# Altium schematic sheet 06_LMS7002M_Power.SchDoc: LMS7002M 1 power supply
size A3 portrait; Organization: Lime Microsystems; Address1: Surrey Tech Centre; Address2: Guildford GU2 7YG; Address3: Surrey; Address4: United Kingdom; Revision: SoDeRa-PCI v1.0; SheetNumber: 6; SheetTotal: 15; PageSetup: Record=PageOptions|CenterHorizontal=True|CenterVertical=True|PrintScale=0.70|XCorrection=1.00|YCorrection=1.00|PrintKind=1|BorderSize=5000000|LeftOffset=0|BottomOffset=0|Orientation=1|PaperLength=2970|PaperWidth=2100|Scale=100|PaperSource=7|PrintQuality=600|MediaType=1|DitherType=10|PrintScaleMode=1|PaperKind=A4|PaperIndex=9
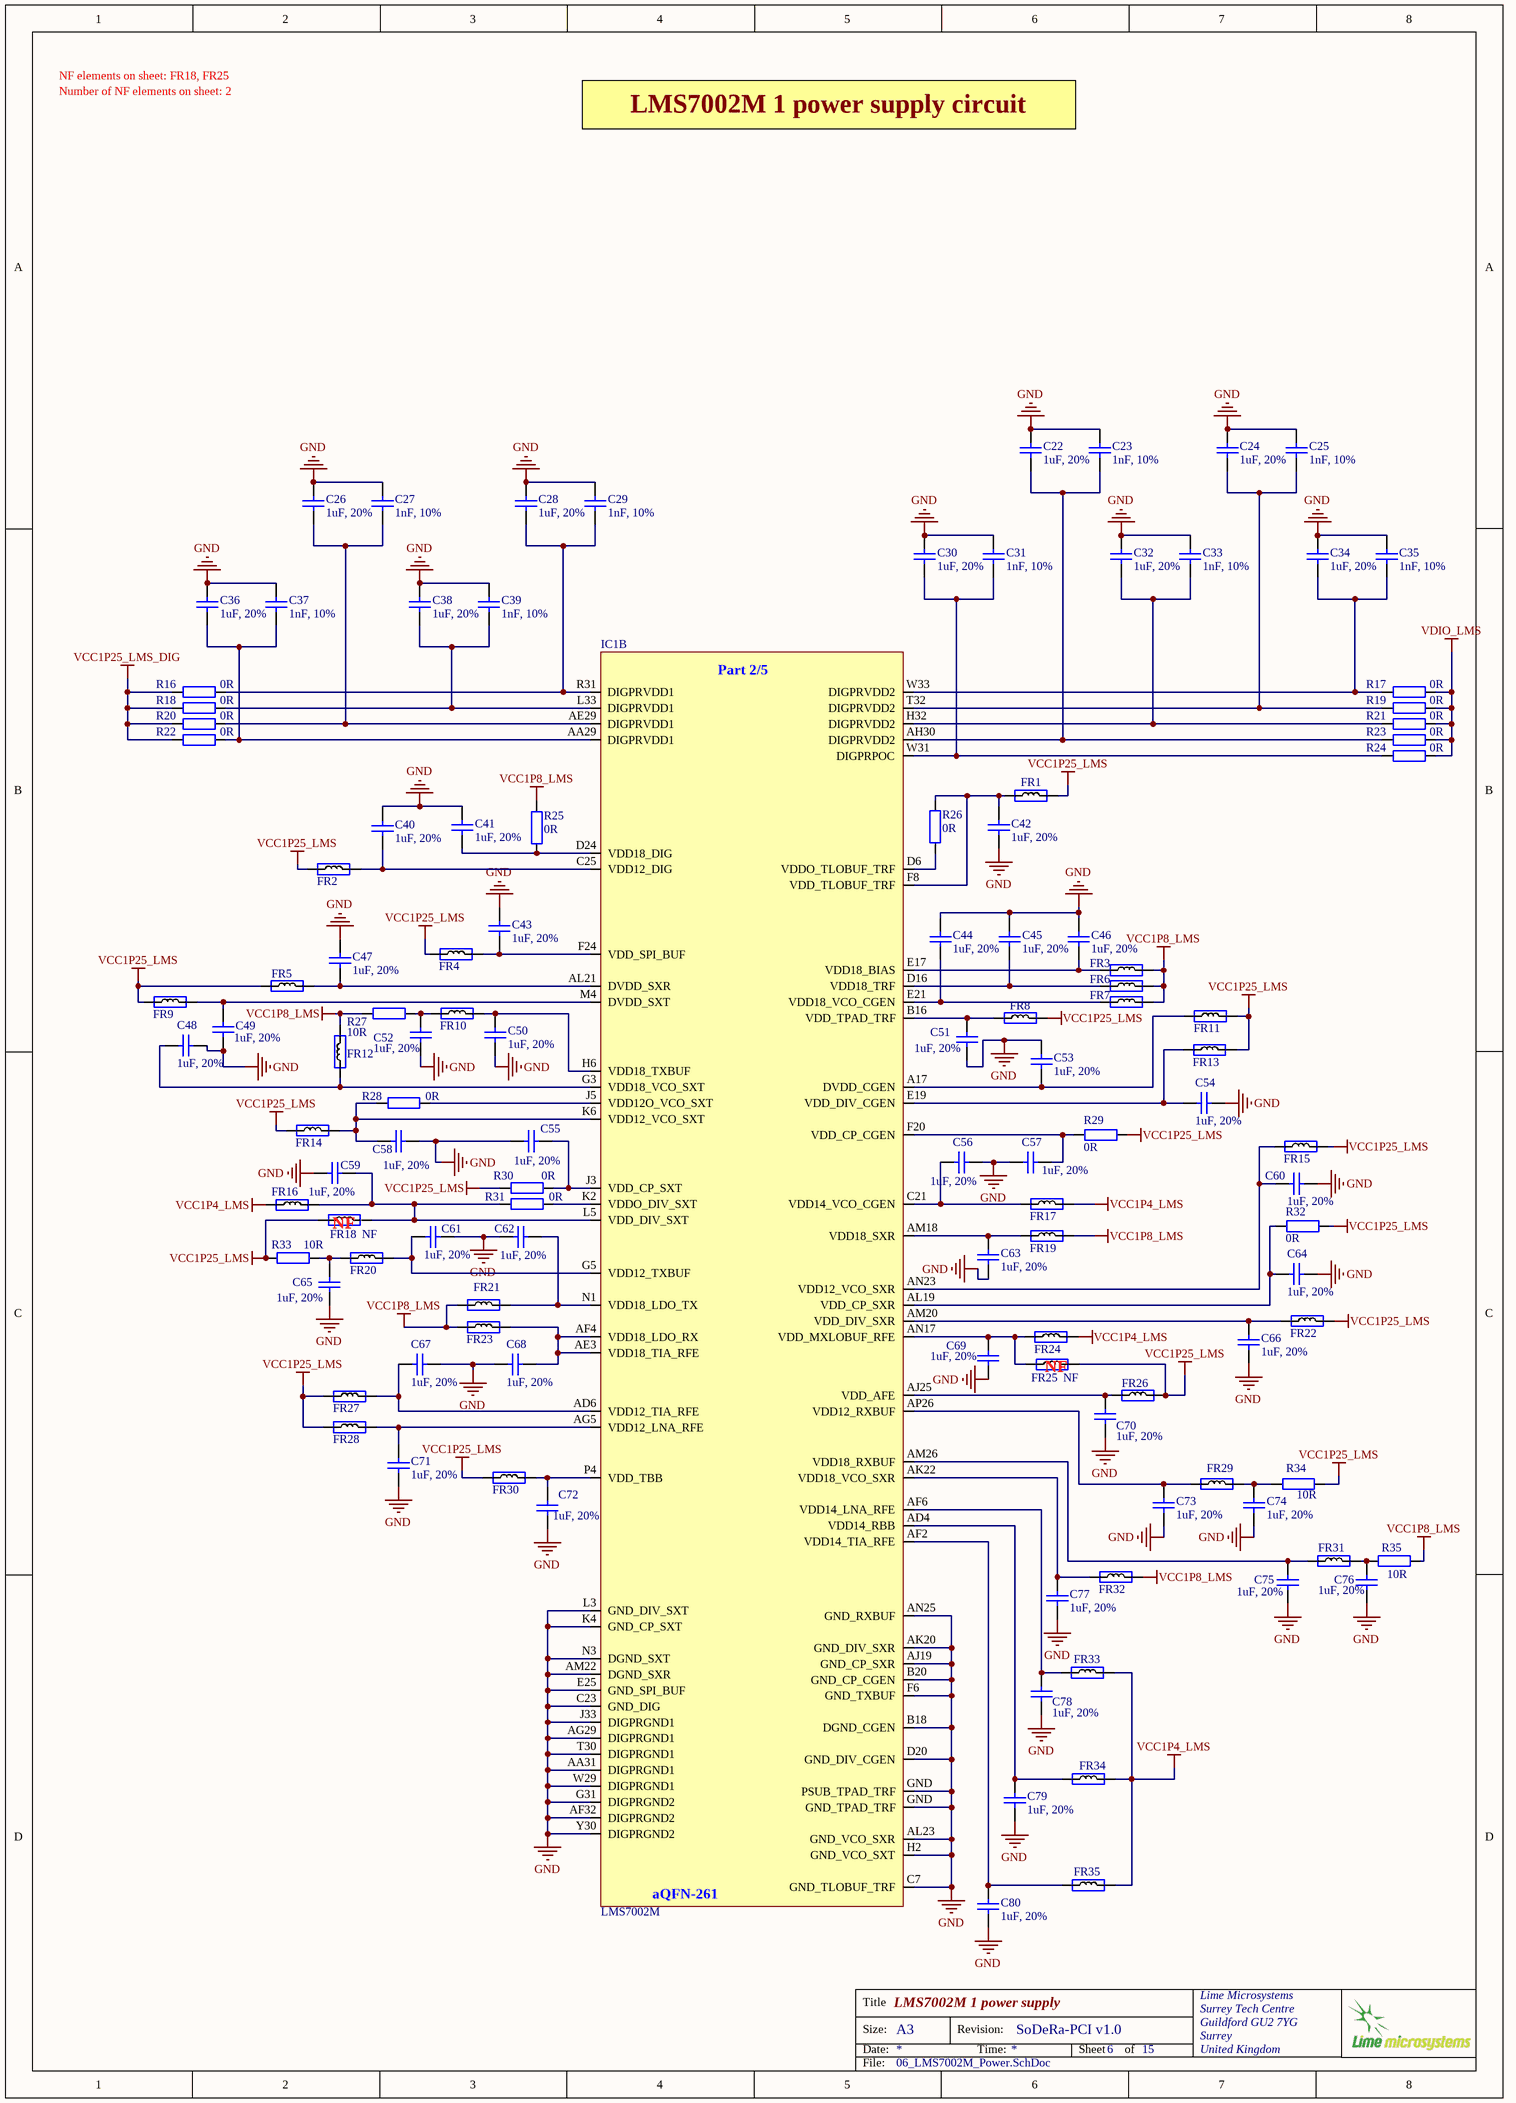
[diagram p0: 06_LMS7002M_Power.SchDoc]

## Parts
C22  1uF, 20%  [CAP0201]
C23  1nF, 10%  [CAP0201]
C24  1uF, 20%  [CAP0201]
C25  1nF, 10%  [CAP0201]
C26  1uF, 20%  [CAP0201]
C27  1nF, 10%  [CAP0201]
C28  1uF, 20%  [CAP0201]
C29  1nF, 10%  [CAP0201]
C30  1uF, 20%  [CAP0201]
C31  1nF, 10%  [CAP0201]
C32  1uF, 20%  [CAP0201]
C33  1nF, 10%  [CAP0201]
C34  1uF, 20%  [CAP0201]
C35  1nF, 10%  [CAP0201]
C36  1uF, 20%  [CAP0201]
C37  1nF, 10%  [CAP0201]
C38  1uF, 20%  [CAP0201]
C39  1nF, 10%  [CAP0201]
C40  1uF, 20%  [CAP0201]
C41  1uF, 20%  [CAP0201]
C42  1uF, 20%  [CAP0201]
C43  1uF, 20%  [CAP0201]
C44  1uF, 20%  [CAP0201]
C45  1uF, 20%  [CAP0201]
C46  1uF, 20%  [CAP0201]
C47  1uF, 20%  [CAP0201]
C48  1uF, 20%  [CAP0201]
C49  1uF, 20%  [CAP0201]
C50  1uF, 20%  [CAP0201]
C51  1uF, 20%  [CAP0201]
C52  1uF, 20%  [CAP0201]
C53  1uF, 20%  [CAP0201]
C54  1uF, 20%  [CAP0201]
C55  1uF, 20%  [CAP0201]
C56  1uF, 20%  [CAP0201]
C57  1uF, 20%  [CAP0201]
C58  1uF, 20%  [CAP0201]
C59  1uF, 20%  [CAP0201]
C60  1uF, 20%  [CAP0201]
C61  1uF, 20%  [CAP0201]
C62  1uF, 20%  [CAP0201]
C63  1uF, 20%  [CAP0201]
C64  1uF, 20%  [CAP0201]
C65  1uF, 20%  [CAP0201]
C66  1uF, 20%  [CAP0201]
C67  1uF, 20%  [CAP0201]
C68  1uF, 20%  [CAP0201]
C69  1uF, 20%  [CAP0201]
C70  1uF, 20%  [CAP0201]
C71  1uF, 20%  [CAP0201]
C72  1uF, 20%  [CAP0201]
C73  1uF, 20%  [CAP0201]
C74  1uF, 20%  [CAP0201]
C75  1uF, 20%  [CAP0201]
C76  1uF, 20%  [CAP0201]
C77  1uF, 20%  [CAP0201]
C78  1uF, 20%  [CAP0201]
C79  1uF, 20%  [CAP0201]
C80  1uF, 20%  [CAP0201]
FR1  Ferrite  [RES0201]  (value not drawn)
FR2  Ferrite  [RES0201]  (value not drawn)
FR3  Ferrite  [RES0201]  (value not drawn)
FR4  Ferrite  [RES0201]  (value not drawn)
FR5  Ferrite  [RES0201]  (value not drawn)
FR6  Ferrite  [RES0201]  (value not drawn)
FR7  Ferrite  [RES0201]  (value not drawn)
FR8  Ferrite  [RES0201]  (value not drawn)
FR9  Ferrite  [RES0201]  (value not drawn)
FR10  Ferrite  [RES0201]  (value not drawn)
FR11  Ferrite  [RES0201]  (value not drawn)
FR12  Ferrite  [RES0201]  (value not drawn)
FR13  Ferrite  [RES0201]  (value not drawn)
FR14  Ferrite  [RES0201]  (value not drawn)
FR15  Ferrite  [RES0201]  (value not drawn)
FR16  Ferrite  [RES0201]  (value not drawn)
FR17  Ferrite  [RES0201]  (value not drawn)
FR18  Assembly Info: NF  [RES0201]  (hidden comment: Ferrite)
FR19  Ferrite  [RES0201]  (value not drawn)
FR20  Ferrite  [RES0201]  (value not drawn)
FR21  Ferrite  [RES0201]  (value not drawn)
FR22  Ferrite  [RES0201]  (value not drawn)
FR23  Ferrite  [RES0201]  (value not drawn)
FR24  Ferrite  [RES0201]  (value not drawn)
FR25  Assembly Info: NF  [RES0201]  (hidden comment: Ferrite)
FR26  Ferrite  [RES0201]  (value not drawn)
FR27  Ferrite  [RES0201]  (value not drawn)
FR28  Ferrite  [RES0201]  (value not drawn)
FR29  Ferrite  [RES0201]  (value not drawn)
FR30  Ferrite  [RES0201]  (value not drawn)
FR31  Ferrite  [RES0201]  (value not drawn)
FR32  Ferrite  [RES0201]  (value not drawn)
FR33  Ferrite  [RES0201]  (value not drawn)
FR34  Ferrite  [RES0201]  (value not drawn)
FR35  Ferrite  [RES0201]  (value not drawn)
IC1  LMS7002M  [LMS7002M]  (part B of 5)
R16  0R  [RES0402]
R17  0R  [RES0402]
R18  0R  [RES0402]
R19  0R  [RES0402]
R20  0R  [RES0402]
R21  0R  [RES0402]
R22  0R  [RES0402]
R23  0R  [RES0402]
R24  0R  [RES0402]
R25  0R  [RES0201]
R26  0R  [RES0201]
R27  10R  [RES0201]
R28  0R  [RES0201]
R29  0R  [RES0201]
R30  0R  [RES0201]
R31  0R  [RES0201]
R32  0R  [RES0201]
R33  10R  [RES0201]
R34  10R  [RES0201]
R35  10R  [RES0201]

## Nets
GND: C22.2 C23.2 C24.2 C25.2 C26.2 C27.2 C28.2 C29.2 C30.2 C31.2 C32.2 C33.2 C34.2 C35.2 C36.2 C37.2 C38.2 C39.2 C40.2 C41.2 C42.2 C43.2 C44.2 C45.2 C46.2 C47.2 C48.2 C49.2 C50.2 C51.2 C52.2 C53.2 C54.2 C55.2 C56.2 C57.2 C58.1 C59.2 C60.2 C61.2 C62.2 C63.2 C64.2 C65.2 C66.2 C67.2 C68.2 C69.2 C70.2 C71.2 C72.2 C73.2 C74.2 C75.2 C76.2 C77.2 C78.2 C79.2 C80.2 IC1.AA31(DIGPRGND1) IC1.AF32(DIGPRGND2) IC1.AG29(DIGPRGND1) IC1.AJ19(GND_CP_SXR) IC1.AK20(GND_DIV_SXR) IC1.AL23(GND_VCO_SXR) IC1.AM22(DGND_SXR) IC1.AN25(GND_RXBUF) IC1.B18(DGND_CGEN) IC1.B20(GND_CP_CGEN) IC1.C7(GND_TLOBUF_TRF) IC1.C23(GND_DIG) IC1.D20(GND_DIV_CGEN) IC1.E25(GND_SPI_BUF) IC1.F6(GND_TXBUF) IC1.G31(DIGPRGND2) IC1.GND(PSUB_TPAD_TRF) IC1.H2(GND_VCO_SXT) IC1.J33(DIGPRGND1) IC1.K4(GND_CP_SXT) IC1.L3(GND_DIV_SXT) IC1.N3(DGND_SXT) IC1.T30(DIGPRGND1) IC1.W29(DIGPRGND1) IC1.Y30(DIGPRGND2)
VCC1P4_LMS: FR16.1 FR17.2 FR24.2 FR33.2 FR34.2 FR35.2
VCC1P8_LMS: FR3.2 FR6.2 FR7.2 FR12.2 FR19.2 FR21.1 FR23.1 FR32.2 R25.2 R27.2 R35.1
VCC1P25_LMS: FR1.2 FR2.1 FR4.1 FR5.1 FR8.2 FR9.1 FR11.2 FR13.2 FR14.1 FR15.2 FR18.1 FR22.2 FR25.2 FR26.2 FR27.1 FR28.1 FR30.1 R29.1 R30.2 R32.1 R33.2 R34.1
VCC1P25_LMS_DIG: R16.2 R18.2 R20.2 R22.2
VDIO_LMS: R17.1 R19.1 R21.1 R23.1 R24.1
NetC22_1: C22.1 C23.1 IC1.AH30(DIGPRVDD2) R23.2
NetC24_1: C24.1 C25.1 IC1.T32(DIGPRVDD2) R19.2
NetC26_1: C26.1 C27.1 IC1.AE29(DIGPRVDD1) R20.1
NetC28_1: C28.1 C29.1 IC1.R31(DIGPRVDD1) R16.1
NetC30_1: C30.1 C31.1 IC1.W31(DIGPRPOC) R24.2
NetC32_1: C32.1 C33.1 IC1.H32(DIGPRVDD2) R21.2
NetC34_1: C34.1 C35.1 IC1.W33(DIGPRVDD2) R17.2
NetC36_1: C36.1 C37.1 IC1.AA29(DIGPRVDD1) R22.1
NetC38_1: C38.1 C39.1 IC1.L33(DIGPRVDD1) R18.1
NetC40_1: C40.1 FR2.2 IC1.C25(VDD12_DIG)
NetC41_1: C41.1 IC1.D24(VDD18_DIG) R25.1
NetC42_1: C42.1 FR1.1 IC1.F8(VDD_TLOBUF_TRF) R26.1
NetC43_1: C43.1 FR4.2 IC1.F24(VDD_SPI_BUF)
NetC44_1: C44.1 FR7.1 IC1.E21(VDD18_VCO_CGEN)
NetC45_1: C45.1 FR6.1 IC1.D16(VDD18_TRF)
NetC46_1: C46.1 FR3.1 IC1.E17(VDD18_BIAS)
NetC47_1: C47.1 FR5.2 IC1.AL21(DVDD_SXR)
NetC48_1: C48.1 FR12.1 IC1.G3(VDD18_VCO_SXT)
NetC49_1: C49.1 FR9.2 IC1.M4(DVDD_SXT)
NetC50_1: C50.1 FR10.2 IC1.H6(VDD18_TXBUF)
NetC51_1: C51.1 FR8.1 IC1.B16(VDD_TPAD_TRF)
NetC52_1: C52.1 FR10.1 R27.1
NetC53_1: C53.1 FR11.1 IC1.A17(DVDD_CGEN)
NetC54_1: C54.1 FR13.1 IC1.E19(VDD_DIV_CGEN)
NetC55_1: C55.1 IC1.J3(VDD_CP_SXT) R30.1
NetC56_1: C56.1 FR17.1 IC1.C21(VDD14_VCO_CGEN)
NetC57_1: C57.1 IC1.F20(VDD_CP_CGEN) R29.2
NetC58_2: C58.2 FR14.2 IC1.K6(VDD12_VCO_SXT) R28.2
NetC59_1: C59.1 FR16.2 FR18.2 IC1.L5(VDD_DIV_SXT) R31.2
NetC60_1: C60.1 FR15.1 IC1.AN23(VDD12_VCO_SXR)
NetC61_1: C61.1 FR20.2 IC1.G5(VDD12_TXBUF)
NetC62_1: C62.1 FR21.2 IC1.N1(VDD18_LDO_TX)
NetC63_1: C63.1 FR19.1 IC1.AM18(VDD18_SXR)
NetC64_1: C64.1 IC1.AL19(VDD_CP_SXR) R32.2
NetC65_1: C65.1 FR20.1 R33.1
NetC66_1: C66.1 FR22.1 IC1.AM20(VDD_DIV_SXR)
NetC67_1: C67.1 FR27.2 IC1.AD6(VDD12_TIA_RFE)
NetC68_1: C68.1 FR23.2 IC1.AE3(VDD18_TIA_RFE) IC1.AF4(VDD18_LDO_RX)
NetC69_1: C69.1 FR24.1 FR25.1 IC1.AN17(VDD_MXLOBUF_RFE)
NetC70_1: C70.1 FR26.1 IC1.AJ25(VDD_AFE)
NetC71_1: C71.1 FR28.2 IC1.AG5(VDD12_LNA_RFE)
NetC72_1: C72.1 FR30.2 IC1.P4(VDD_TBB)
NetC73_1: C73.1 FR29.1 IC1.AP26(VDD12_RXBUF)
NetC74_1: C74.1 FR29.2 R34.2
NetC75_1: C75.1 FR31.1 IC1.AM26(VDD18_RXBUF)
NetC76_1: C76.1 FR31.2 R35.2
NetC77_1: C77.1 FR32.1 IC1.AK22(VDD18_VCO_SXR)
NetC78_1: C78.1 FR33.1 IC1.AF6(VDD14_LNA_RFE)
NetC79_1: C79.1 FR34.1 IC1.AD4(VDD14_RBB)
NetC80_1: C80.1 FR35.1 IC1.AF2(VDD14_TIA_RFE)
NetIC1_D6: IC1.D6(VDDO_TLOBUF_TRF) R26.2
NetIC1_J5: IC1.J5(VDD12O_VCO_SXT) R28.1
NetIC1_K2: IC1.K2(VDDO_DIV_SXT) R31.1

## Notes on the sheet
- Number of NF elements on sheet: 2
- NF elements on sheet: FR18, FR25
- LMS7002M 1 power supply circuit
- (near FR18) NF
- (near FR25) NF
- Title
- Size:
- Date:
- A3
- Revision:
- Time:
- Sheet
- of
- File:
- (in symbol LMS7002M, part B) Part 2/5; aQFN-261

## Library data of the parts
C22 C24 C26 C28 C30 C32 C34 C36 C38 C40-C80 = Cap_0402: Manufacturer: TDK Corporation; Manufacturer Part Number 1: C0603X5R0J105M030BC; Capacitance: 1.0µF; Voltage - Rated: 6.3V; Temperature Coefficient: X5R; Value: 1uF, 20%; Supplier 1: Digi-Key; Supplier Part Number 1: 445-8008-1-ND; Applications: General Purpose; Features: -; Lead Style: -; Ratings: -; Thickness (Max): -; Lead Spacing: -; Height - Seated (Max): -; Size / Dimension: 0.024" L x 0.012" W (0.60mm x 0.30mm); Mounting Type: Surface Mount, MLCC; Operating Temperature: -55°C ~ 85°C; Package / Case: 0201 (0603 Metric); Tolerance: ±20%; Packaging: Cut Tape (CT); Category: Capacitors; RoHS: RoHS Compliant
C23 C25 C27 C29 C31 C33 C35 C37 C39 = Cap_0402: Manufacturer Part Number 1: C0603X7R1E102K030BA; Manufacturer: TDK Corporation; Voltage - Rated: 25V; Temperature Coefficient: X7R; Capacitance: 1000pF; Value: 1nF, 10%; Supplier 1: Digi-Key; Supplier Part Number 1: 445-7275-1-ND; Features: -; Package / Case: 0201 (0603 Metric); Lead Spacing: -; Mounting Type: Surface Mount, MLCC; Lead Style: -; Height - Seated (Max): -; Operating Temperature: -55°C ~ 125°C; Tolerance: ±10%; Size / Dimension: 0.024" L x 0.012" W (0.60mm x 0.30mm); Applications: General Purpose; Ratings: -; Thickness (Max): 0.013" (0.33mm); RoHS: RoHS Compliant; Packaging: Cut Tape (CT); Category: Capacitors
FR1-FR35 = Ferrite: Manufacturer Part Number 1: BK0603TS601-T; Manufacturer: Taiyo Yuden; DC Resistance (DCR): 750 mOhm Max; Filter Type: Differential Mode - Single; Impedance @ Frequency: 600 Ohm @ 100MHz; Current Rating: 270mA; Value: 600R@100MHz; Supplier 1: Digi-Key; Supplier Part Number 1: 587-3277-1-ND; Size / Dimension: 0.024" L x 0.012" W (0.60mm x 0.30mm); Package / Case: 0201 (0603 Metric); Height (Max): 0.013" (0.33mm); Mounting Type: Surface Mount; Packaging: Cut Tape (CT); RoHS: RoHS Compliant; Category: Filters
R16-R24 = Res_0402: Manufacturer Part Number 1: RC0402JR-070RL; Manufacturer: Yageo; Resistance (Ohms): 0.0; Tolerance: Jumper; Power (Watts): 0.063W, 1/16W; Value: 0R; Supplier 1: Digi-Key; Supplier Part Number 1: 311-0.0JRTR-ND; Category: Resistors; Temperature Coefficient: -; Features: Moisture Resistant; Supplier Device Package: 0402; Height: 0.016" (0.40mm); Package / Case: 0402 (1005 Metric); Operating Temperature: -55°C ~ 155°C; Size / Dimension: 0.039" L x 0.020" W (1.00mm x 0.50mm); Composition: Thick Film; Packaging: Tape & Reel (TR); Number of Terminations: 2; RoHS: RoHS Compliant
R25 R26 R28-R32 = Res_0402: Manufacturer Part Number 1: MCR006YRTJ000; Manufacturer: Rohm Semiconductor; Resistance (Ohms): 0.0; Power (Watts): 0.05W, 1/20W; Tolerance: Jumper; Value: 0R; Supplier 1: Digi-Key; Supplier Part Number 1: RHM0.0CCCT-ND; Number of Terminations: 2; Operating Temperature: -55°C ~ 125°C; Package / Case: 0201 (0603 Metric); Height: 0.010" (0.26mm); Supplier Device Package: 0201 (0603 Metric); Size / Dimension: 0.024" L x 0.012" W (0.60mm x 0.30mm); Temperature Coefficient: -; Category: Resistors; Features: -; RoHS: RoHS Compliant; Composition: Thick Film; Packaging: Cut Tape (CT)
R27 R33-R35 = Res_0402: Manufacturer: Panasonic Electronic Components; Manufacturer Part Number: ERJ-1GEF10R0C; Power (Watts): 0.05W, 1/20W; Resistance (Ohms): 10; Tolerance: ±1%; Temperature Coefficient: ±200ppm/°C; Value: 10R; Supplier 1: Digi-Key; Supplier Part Number 1: P10.0ABCT-ND; Package / Case: 0201 (0603 Metric); Height: 0.010" (0.26mm); Supplier Device Package: 0201; Packaging: Cut Tape (CT); Composition: Thick Film; Category: Resistors; Number of Terminations: 2; Size / Dimension: 0.024" L x 0.012" W (0.60mm x 0.30mm); Operating Temperature: -55°C ~ 125°C; Features: -; RoHS: RoHS Compliant
IC1 = LMS7002M: Manufacturer Part Number 1: LMS7002M; Supplier 1: Lime Microsystems